# Altium schematic sheet frostlightmini-schematic-altium.schdoc
size 304 x 217 mm
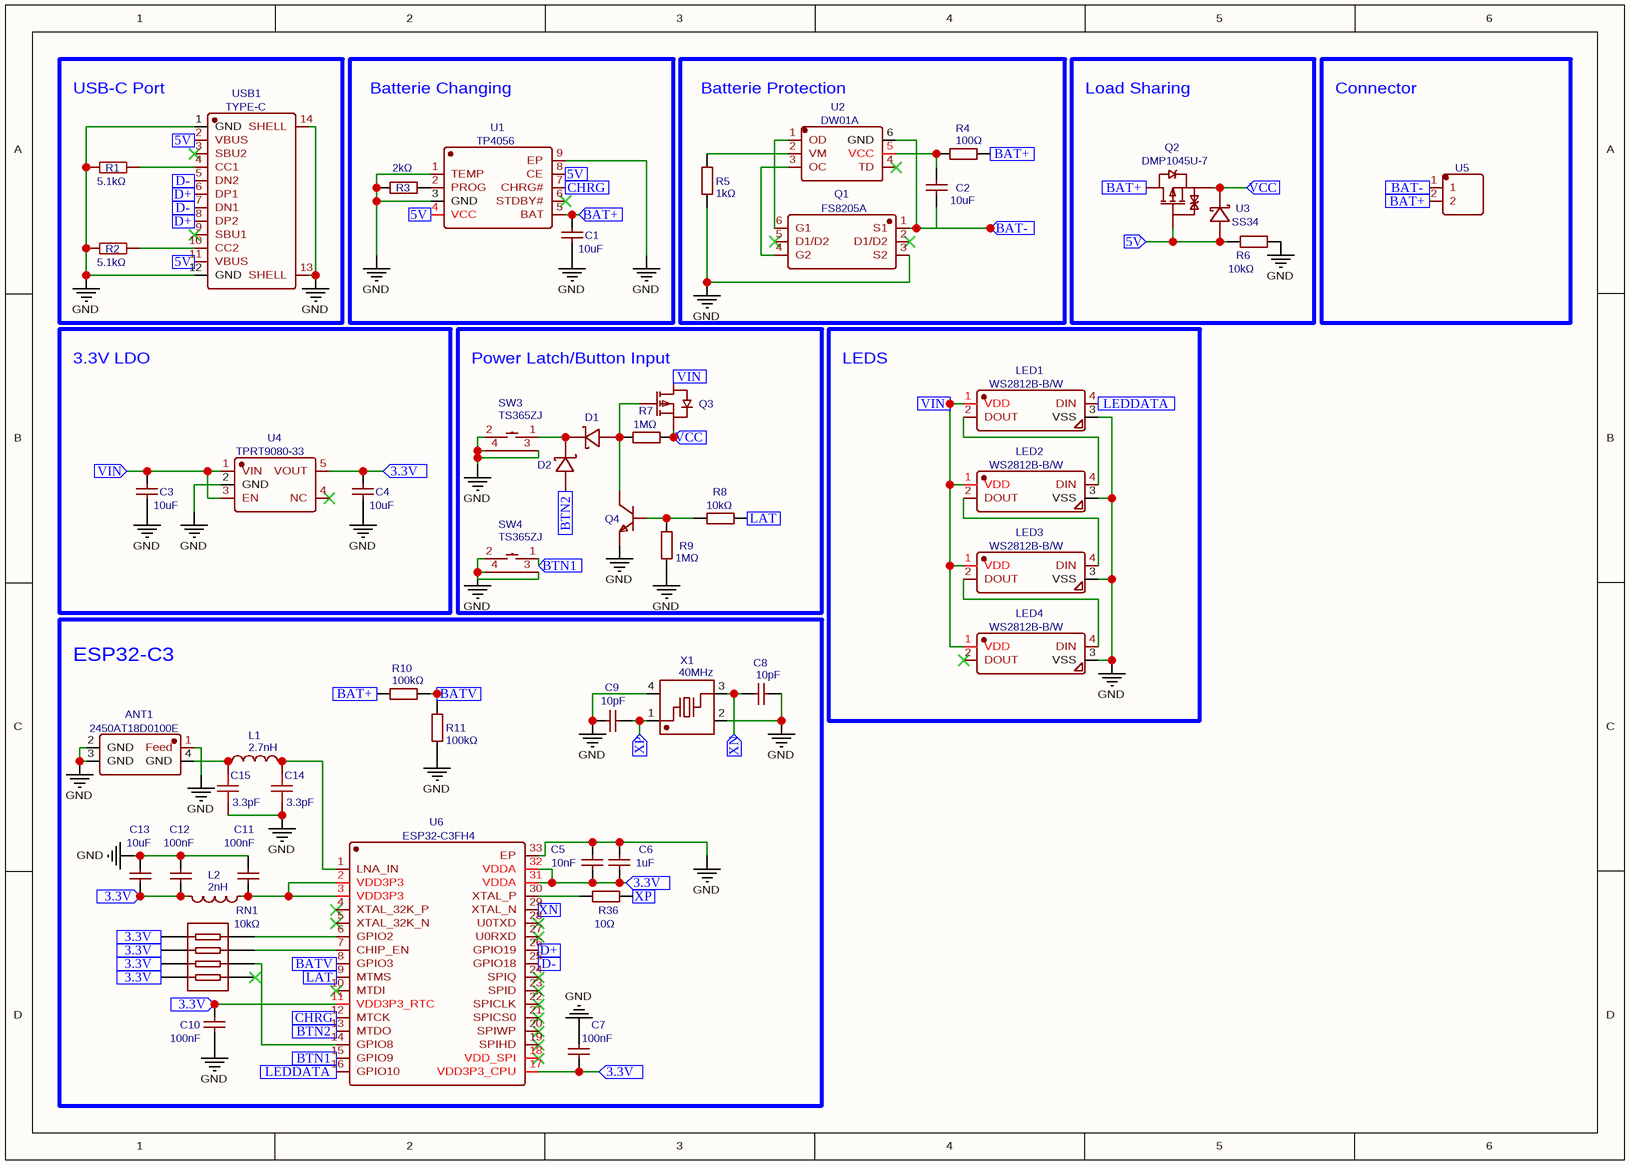
[diagram p0: frostlightmini-schematic-altium.schdoc]

## Parts
ANT1  2450AT18D0100E  [ANT-SMD_4P-L3.2-W1.6]
C1  10uF  [C0402]
C2  10uF  [C0402]
C3  10uF  [C0402]
C4  10uF  [C0402]
C5  10nF  [C0402]
C6  1uF  [C0402]
C7  100nF  [C0402]
C8  10pF  [C0402]
C9  10pF  [C0402]
C10  100nF  [C0402]
C11  100nF  [C0402]
C12  100nF  [C0402]
C13  10uF  [C0402]
C14  3.3pF  [C0402]
C15  3.3pF  [C0402]
D1  BAT42W  [SOD-123_L2.8-W1.8-LS3.7-RD]  (value not drawn)
D2  BAT42W  [SOD-123_L2.8-W1.8-LS3.7-RD]  (value not drawn)
L1  2.7nH  [L0402]
L2  2nH  [L0402]
LED1  WS2812B-B/W  [LED-SMD_4P-L5.0-W5.0-TL_WS2812B-B]
LED2  WS2812B-B/W  [LED-SMD_4P-L5.0-W5.0-TL_WS2812B-B]
LED3  WS2812B-B/W  [LED-SMD_4P-L5.0-W5.0-TL_WS2812B-B]
LED4  WS2812B-B/W  [LED-SMD_4P-L5.0-W5.0-TL_WS2812B-B]
Q1  FS8205A  [SOT-23-6_L2.9-W1.6-P0.95-LS2.8-BR]
Q2  DMP1045U-7  [SOT-23-3_L2.9-W1.3-P1.90-LS2.4-BR]
Q3  SI2301_C2891731  [SOT-23-3_L2.9-W1.3-P1.90-LS2.4-BR]  (value not drawn)
Q4  S8050_C20069125  [SOT-23-3_L2.9-W1.3-P1.90-LS2.3-BR]  (value not drawn)
R1  5.1kΩ  [R0201]
R2  5.1kΩ  [R0201]
R3  2kΩ  [R0402]
R4  100Ω  [R0402]
R5  1kΩ  [R0402]
R6  10kΩ  [R0402]
R7  1MΩ  [R0402]
R8  10kΩ  [R0402]
R9  1MΩ  [R0402]
R10  100kΩ  [R0402]
R11  100kΩ  [R0402]
R36  10Ω  [R0402]
RN1  10kΩ  [RES-ARRAY-SMD_0603-8P-L3.2-W1.6-BL]
SW3  TS365ZJ  [KEY-TH_TS365ZJ]
SW4  TS365ZJ  [KEY-TH_TS365ZJ]
U1  TP4056  [ESOP-8_L4.9-W3.9-P1.27-LS6.0-BL-EP]
U2  DW01A  [SOT-23-6_L2.9-W1.6-P0.95-LS2.8-BL]
U3  SS34  [DO-214AC_L4.3-W2.7-LS5.2-RD]
U4  TPRT9080-33  [SOT-23-5_L2.9-W1.6-P0.95-LS2.8-BR]
U5  S2B-PH-K-S(LF)(SN)  [CONN-TH_S2B-PH-K-S-LF-SN]  (value not drawn)
U6  ESP32-C3FH4  [QFN-32_L5.0-W5.0-P0.50-TL-EP3.7]
USB1  TYPE-C  [USB-C-SMD_TYPE-C-6PIN-2MD-073]
X1  40MHz  [CRYSTAL-SMD_4P-L3.2-W2.5-BL]

## Blocks framed on the sheet
USB-C Port: R1 R2 USB1
Batterie Changing: C1 R3 U1
Batterie Protection: C2 Q1 R4 R5 U2
Load Sharing: Q2 R6 U3
Connector: U5
3.3V LDO: C3 C4 U4
Power Latch/Button Input: D1 D2 Q3 Q4 R7-R9 SW3 SW4
LEDS: LED1-LED4
ESP32-C3: ANT1 C5-C15 L1 L2 R10 R11 R36 RN1 U6 X1

## Ports
3.3V (in), 5V (in), BAT+ (in), BAT- (in), BATV (in), BTN1 (in), BTN2 (in), CHRG (in), D+ (in), D- (in), LAT (in), LEDDATA (in), VCC (in), VIN (in), XN (in), XP (in)

## Nets
GND: ANT1.1(Feed) ANT1.2(GND) ANT1.3(GND) C1.2 C3.2 C4.2 C5.1 C6.1 C7.2 C8.2 C9.1 C10.2 C11.1 C12.1 C13.1 C14.2 C15.2 LED1.3(VSS) LED2.3(VSS) LED3.3(VSS) LED4.3(VSS) Q1.3(S2) Q4.2(E) R1.1 R2.1 R3.1 R5.1 R6.2 R9.1 R11.1 SW3.2 SW3.3 SW3.4 SW4.2 SW4.3 SW4.4 U1.1(TEMP) U1.3(GND) U1.9(EP) U4.2(GND) U6.33(EP) USB1.1(GND) USB1.12(GND) USB1.13(SHELL) USB1.14(SHELL) X1.2(GND) X1.4(GND)
3.3V: C4.1 C5.2 C6.2 C7.1 C10.1 C12.2 C13.2 L2.2 RN1.1 RN1.2 RN1.3 RN1.4 U4.5(VOUT) U6.11(VDD3P3_RTC) U6.17(VDD3P3_CPU) U6.31(VDDA) U6.32(VDDA) ; port 3.3V
5V: Q2.1(G) R6.1 U1.4(VCC) U1.8(CE) U3.2(A) USB1.2(VBUS) USB1.11(VBUS) ; port 5V
BAT+: C1.1 Q2.3(D) R4.2 R10.1 U1.5(BAT) U5.2 ; port BAT+
BAT-: C2.1 Q1.1(S1) U2.6(GND) U5.1 ; port BAT-
BATV: R10.2 R11.2 U6.8(GPIO3) ; port BATV
BTN1: SW4.1 U6.15(GPIO9) ; port BTN1
BTN2: D2.2(A) U6.13(MTDO) ; port BTN2
CHRG: U1.7(CHRG#) U6.12(MTCK) ; port CHRG
D+: U6.26(GPIO19) USB1.6(DP1) USB1.8(DP2) ; port D+
D-: U6.25(GPIO18) USB1.5(DN2) USB1.7(DN1) ; port D-
LAT: R8.2 U6.9(MTMS) ; port LAT
LEDDATA: LED1.4(DIN) U6.16(GPIO10) ; port LEDDATA
VCC: Q2.2(S) Q3.2(S) R7.2 U3.1(C) ; port VCC
VIN: C3.1 LED1.1(VDD) LED2.1(VDD) LED3.1(VDD) LED4.1(VDD) Q3.3(D) U4.1(VIN) U4.3(EN) ; port VIN
XN: C8.1 U6.29(XTAL_N) X1.3 ; port XN
XP: C9.2 R36.2 X1.1 ; port XP
NetANT1_4: ANT1.4(GND) C15.1 L1.1
NetC2_2: C2.2 R4.1 U2.5(VCC)
NetC11_2: C11.2 L2.1 U6.2(VDD3P3) U6.3(VDD3P3)
NetC14_1: C14.1 L1.2 U6.1(LNA_IN)
NetD1_1: D1.1(C) D2.1(C) SW3.1
NetD1_2: D1.2(A) Q3.1(G) Q4.3(C) R7.1
NetLED1_2: LED1.2(DOUT) LED2.4(DIN)
NetLED2_2: LED2.2(DOUT) LED3.4(DIN)
NetLED3_2: LED3.2(DOUT) LED4.4(DIN)
NetQ1_4: Q1.4(G2) U2.3(OC)
NetQ1_6: Q1.6(G1) U2.1(OD)
NetQ4_1: Q4.1(B) R8.1 R9.2
NetR1_2: R1.2 USB1.4(CC1)
NetR2_2: R2.2 USB1.10(CC2)
NetR3_2: R3.2 U1.2(PROG)
NetR5_2: R5.2 U2.2(VM)
NetR36_1: R36.1 U6.30(XTAL_P)
NetRN1_6: RN1.6 U6.14(GPIO8)
NetRN1_7: RN1.7 U6.7(CHIP_EN)
NetRN1_8: RN1.8 U6.6(GPIO2)

Not connected (* = marked no-connect by the designer): LED4 2(DOUT)*; Q1 2(D1/D2)* 5(D1/D2)*; RN1 5*; U1 6(STDBY#)*; U2 4(TD)*; U4 4(NC)*; U6 4(XTAL_32K_P)* 5(XTAL_32K_N)* 10(MTDI)* 18(VDD_SPI)* 19(SPIHD)* 20(SPIWP)* 21(SPICS0)* 22(SPICLK)* 23(SPID)* 24(SPIQ)* 27(U0RXD)* 28(U0TXD)*; USB1 3(SBU2)* 9(SBU1)*

## Library data of the parts
ANT1 = 2450AT18D0100E: Manufacturer: JOHANSON(约翰逊); Contributor: lcsc; Supplier: LCSC; Supplier Part: C2917718; Manufacturer Part: 2450AT18D0100E; JLCPCB Part Class: Extended Part; spicePre: A; spiceSymbolName: 2450AT18D0100E
C1-C4 C13 = 10uF: Manufacturer Part: CL05A106MQ5NUNC; Manufacturer: SAMSUNG(三星); nameAlias: Value; Supplier: LCSC; Supplier Part: C15525; JLCPCB Part Class: Basic Part; spicePre: C; spiceSymbolName: CL05A106MQ5NUNC
  C1 C3 C4: link: https://lcsc.com/eda_search?q=C15525&%26type=1&ref=editor
C5 = 10nF: Manufacturer Part: CC0402KRX7R9BB103; Manufacturer: YAGEO(国巨); nameAlias: Value; Supplier: LCSC; Supplier Part: C60133; JLCPCB Part Class: Extended Part; spicePre: C; spiceSymbolName: CC0402KRX7R9BB103
C6 = 1uF: Manufacturer Part: CL05A105KP5NNNC; Manufacturer: SAMSUNG(三星); nameAlias: Value; Supplier: LCSC; Supplier Part: C14445; JLCPCB Part Class: Extended Part; spicePre: C; spiceSymbolName: CL05A105KP5NNNC
C7 C10-C12 = 100nF: Manufacturer Part: CL05B104KO5NNNC; Manufacturer: SAMSUNG(三星); nameAlias: Value; Supplier: LCSC; Supplier Part: C1525; JLCPCB Part Class: Basic Part; spicePre: C; spiceSymbolName: CL05B104KO5NNNC
C8 C9 = 10pF: Manufacturer: FH(风华); Manufacturer Part: 0402CG100J500NT; nameAlias: Value; Supplier: LCSC; Supplier Part: C1545; JLCPCB Part Class: Extended Part; spicePre: C; spiceSymbolName: 0402CG100J500NT
C14 C15 = 3.3pF: Manufacturer: muRata(村田); Manufacturer Part: GJM1555C1H3R3WB01D; nameAlias: Value; Supplier: LCSC; Supplier Part: C88892; JLCPCB Part Class: Extended Part; spicePre: C; spiceSymbolName: GJM1555C1H3R3WB01D
D1 D2 = BAT42W: Manufacturer: SHIKUES(时科); Contributor: LCSC; Supplier: LCSC; Manufacturer Part: BAT42W; Supplier Part: C130886; JLCPCB Part Class: Extended Part; spicePre: D; spiceSymbolName: BAT42W
L1 = 2.7nH: Manufacturer Part: LQG15HS2N7S02D; Manufacturer: muRata(村田); nameAlias: Value; Supplier: LCSC; Supplier Part: C77108; JLCPCB Part Class: Extended Part; spicePre: L; spiceSymbolName: LQG15HS2N7S02D
L2 = 2nH: Manufacturer Part: LQG15HS2N0S02D; Manufacturer: muRata(村田); nameAlias: Value; Supplier: LCSC; Supplier Part: C18216; JLCPCB Part Class: Extended Part; spicePre: L; spiceSymbolName: LQG15HS2N0S02D
LED1-LED4 = WS2812B-B/W: Manufacturer: worldsemi; Manufacturer Part: WS2812B-B/T; Contributor: LCSC; Supplier: LCSC; Supplier Part: C2761795; JLCPCB Part Class: Extended Part; spicePre: L; spiceSymbolName: WS2812B-B/W
Q1 = FS8205A: Manufacturer: TECH PUBLIC(台舟); Contributor: LCSC; Supplier: LCSC; Supplier Part: C2830320; Manufacturer Part: FS8205A; JLCPCB Part Class: Extended Part; spicePre: Q; spiceSymbolName: FS8205A_C2830320
Q2 = DMP1045U-7: Manufacturer: DIODES(美台); Contributor: LCSC; Supplier: LCSC; Supplier Part: C177033; Manufacturer Part: DMP1045U-7; JLCPCB Part Class: Extended Part; spicePre: Q; spiceSymbolName: DMP1045U-7
Q3 = SI2301_C2891731: Manufacturer: YONGYUTAI(永裕泰); Manufacturer Part: SI2301; Contributor: LCSC; Supplier: LCSC; Supplier Part: C2891731; JLCPCB Part Class: Extended Part; spicePre: Q; spiceSymbolName: SI2301_C2891731
Q4 = S8050_C20069125: Manufacturer: 宏嘉诚; Manufacturer Part: S8050; Contributor: lcsc; Supplier: LCSC; Supplier Part: C20069125; JLCPCB Part Class: Extended Part; spicePre: Q; spiceSymbolName: S8050_C20069125
R1 R2 = 5.1kΩ: Manufacturer: UNI-ROYAL(厚声); Manufacturer Part: 0201WMF5101TEE; nameAlias: Value; Contributor: LCSC; Supplier: LCSC; Supplier Part: C270344; JLCPCB Part Class: Extended Part; spicePre: R; spiceSymbolName: 0201WMF5101TEE
R3 = 2kΩ: Manufacturer Part: 0402WGF2001TCE; Manufacturer: UNI-ROYAL(厚声); nameAlias: Value; Supplier: LCSC; Supplier Part: C4109; JLCPCB Part Class: Basic Part; spicePre: R; spiceSymbolName: 0402WGF2001TCE
R4 = 100Ω: Manufacturer: UNI-ROYAL(厚声); Manufacturer Part: 0402WGF1000TCE; nameAlias: Value; Supplier: LCSC; Supplier Part: C25076; JLCPCB Part Class: Basic Part; spicePre: R; spiceSymbolName: 0402WGF1000TCE
R5 = 1kΩ: Manufacturer: YAGEO(国巨); Manufacturer Part: RC0402FR-071KL; nameAlias: Value; Supplier: LCSC; Supplier Part: C106235; JLCPCB Part Class: Extended Part; spicePre: R; spiceSymbolName: RC0402FR-071KL
R6 R8 = 10kΩ: Manufacturer: YAGEO(国巨); Manufacturer Part: RC0402FR-0710KL; nameAlias: Value; Supplier: LCSC; Supplier Part: C60490; JLCPCB Part Class: Extended Part; spicePre: R; spiceSymbolName: RC0402FR-0710KL
R7 R9 = 1MΩ: Manufacturer: YAGEO(国巨); Manufacturer Part: RC0402FR-071ML; nameAlias: Value; Supplier: LCSC; Supplier Part: C138033; JLCPCB Part Class: Extended Part; spicePre: R; spiceSymbolName: RC0402FR-071ML
R10 R11 = 100kΩ: Manufacturer: YAGEO(国巨); Manufacturer Part: RC0402FR-07100KL; nameAlias: Value; Supplier: LCSC; Supplier Part: C60491; JLCPCB Part Class: Extended Part; spicePre: R; spiceSymbolName: RC0402FR-07100KL
R36 = 10Ω: Manufacturer: UNI-ROYAL(厚声); Manufacturer Part: 0402WGF100JTCE; nameAlias: Value; Supplier: LCSC; Supplier Part: C25077; JLCPCB Part Class: Basic Part; spicePre: R; spiceSymbolName: 0402WGF100JTCE
RN1 = 10kΩ: Manufacturer: UNI-ROYAL(厚声); Manufacturer Part: 4D03WGJ0103T5E; nameAlias: Value; Supplier: LCSC; Supplier Part: C29718; JLCPCB Part Class: Basic Part; spicePre: R; spiceSymbolName: 4D03WGJ0103T5E
SW3 SW4 = TS365ZJ: Manufacturer: SHOU HAN(首韩); Contributor: LCSC; Supplier: LCSC; Supplier Part: C557598; Manufacturer Part: TS365ZJ; JLCPCB Part Class: Extended Part; spicePre: S; spiceSymbolName: TS365ZJ
U1 = TP4056: Manufacturer: TECH PUBLIC(台舟); Contributor: lcsc; Supplier: LCSC; Supplier Part: C5311018; Manufacturer Part: TP4056; JLCPCB Part Class: Extended Part; spicePre: U; spiceSymbolName: TP4056_C5311018
U2 = DW01A: Manufacturer: PUOLOP(迪浦); Contributor: LCSC; Supplier: LCSC; Supplier Part: C351410; Manufacturer Part: DW01A; JLCPCB Part Class: Extended Part; spicePre: U; spiceSymbolName: DW01A_C351410
U3 = SS34: Manufacturer: YFW(佑风微); Contributor: lcsc; Supplier: LCSC; Supplier Part: C3039962; Manufacturer Part: SS34; JLCPCB Part Class: Extended Part; spicePre: U; spiceSymbolName: SS34_C3039962
U4 = TPRT9080-33: Manufacturer: TECH PUBLIC(台舟); Manufacturer Part: TPRT9080-33GJ5; Contributor: LCSC; Supplier: LCSC; Supplier Part: C2959864; JLCPCB Part Class: Extended Part; spicePre: U; spiceSymbolName: TPRT9080-33GJ5
U5 = S2B-PH-K-S(LF)(SN): Manufacturer: JST; Contributor: LCSC; Supplier: LCSC; Supplier Part: C173752; Manufacturer Part: S2B-PH-K-S(LF)(SN); JLCPCB Part Class: Extended Part; link: https://lcsc.com/eda_search?q=C173752&%26type=1&ref=editor; spicePre: U; spiceSymbolName: S2B-PH-K-S(LF)(SN)
U6 = ESP32-C3FH4: Manufacturer: ESPRESSIF(乐鑫); Contributor: LCSC; Supplier: LCSC; Supplier Part: C2858491; Manufacturer Part: ESP32-C3FH4; JLCPCB Part Class: Extended Part; spicePre: U; spiceSymbolName: ESP32-C3FH4
USB1 = TYPE-C: Manufacturer: SHOU HAN(首韩); Manufacturer Part: TYPE-C 16PIN 2MD(073); Contributor: LCSC; Supplier: LCSC; Supplier Part: C2765186; JLCPCB Part Class: Extended Part; spicePre: U; spiceSymbolName: TYPE-C 16PIN 2MD(073)
X1 = 40MHz: Manufacturer: HD(浩都频率); Manufacturer Part: 7B040000M01; nameAlias: Value; Contributor: LCSC; Supplier: LCSC; Supplier Part: C655034; JLCPCB Part Class: Extended Part; link: https://lcsc.com/eda_search?q=C655034&%26type=1&ref=editor; spicePre: X; spiceSymbolName: 7B040000M01